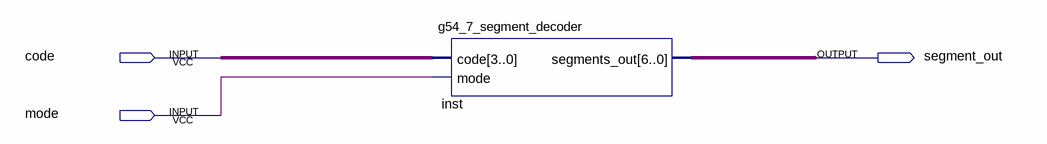
[diagram p0: schematic sheet]
// Quartus schematic g54_7_segment_decoder_BLOCK.bdf as structural Verilog: 1 symbols, 3 pins
module g54_7_segment_decoder_BLOCK (
  input  code,
  input  mode,
  output segment_out
);

  wire [3:0] undriven;
  wire [6:0] inst_segments_out;

  g54_7_segment_decoder inst (.code(undriven), .mode(mode), .segments_out(inst_segments_out));
endmodule
